# EAGLE schematic custom_keithlyV2 (EAGLE 9.3.0)
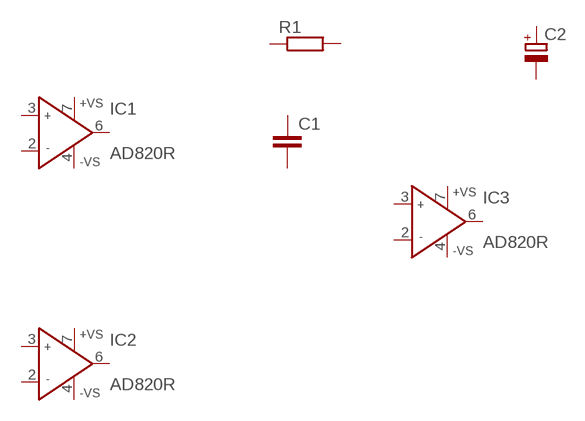
[diagram p0: schematic, sheet 1]

## Parts
C1  C-EUC0805  [C0805]
C2  CPOL-EUA/3216-18W  [A/3216-18W]
IC1  AD820R  [SO8]
IC2  AD820R  [SO8]
IC3  AD820R  [SO8]
R1  R-EU_R0805  [R0805]
Unconnected: C1.1 C1.2 C2.+ C2.- IC1.2(IN-) IC1.3(IN+) IC1.4(-VS) IC1.6(OUT) IC1.7(+VS) IC2.2(IN-) IC2.3(IN+) IC2.4(-VS) IC2.6(OUT) IC2.7(+VS) IC3.2(IN-) IC3.3(IN+) IC3.4(-VS) IC3.6(OUT) IC3.7(+VS) R1.1 R1.2

## Library data of the parts
C1 = rcl:C-EU: CAPACITOR, European symbol; SPICEPREFIX: C
C2 = rcl:CPOL-EU: POLARIZED CAPACITOR, European symbol; SPICEPREFIX: C
IC1-IC3 = analog-devices:AD820: Single-Supply, Rail-to-Rail, Low Power, FET Input Op Amp Source: http://www.analog.com/static/imported-files/data_sheets/AD820.pdf; OC_FARNELL: 1838867; OC_NEWARK: unknown
R1 = rcl:R-EU_: RESISTOR, European symbol; SPICEPREFIX: R